# EasyEDA Pro project ProPrj_STM32G474RET6_2026-01-30.epro, board PCB1
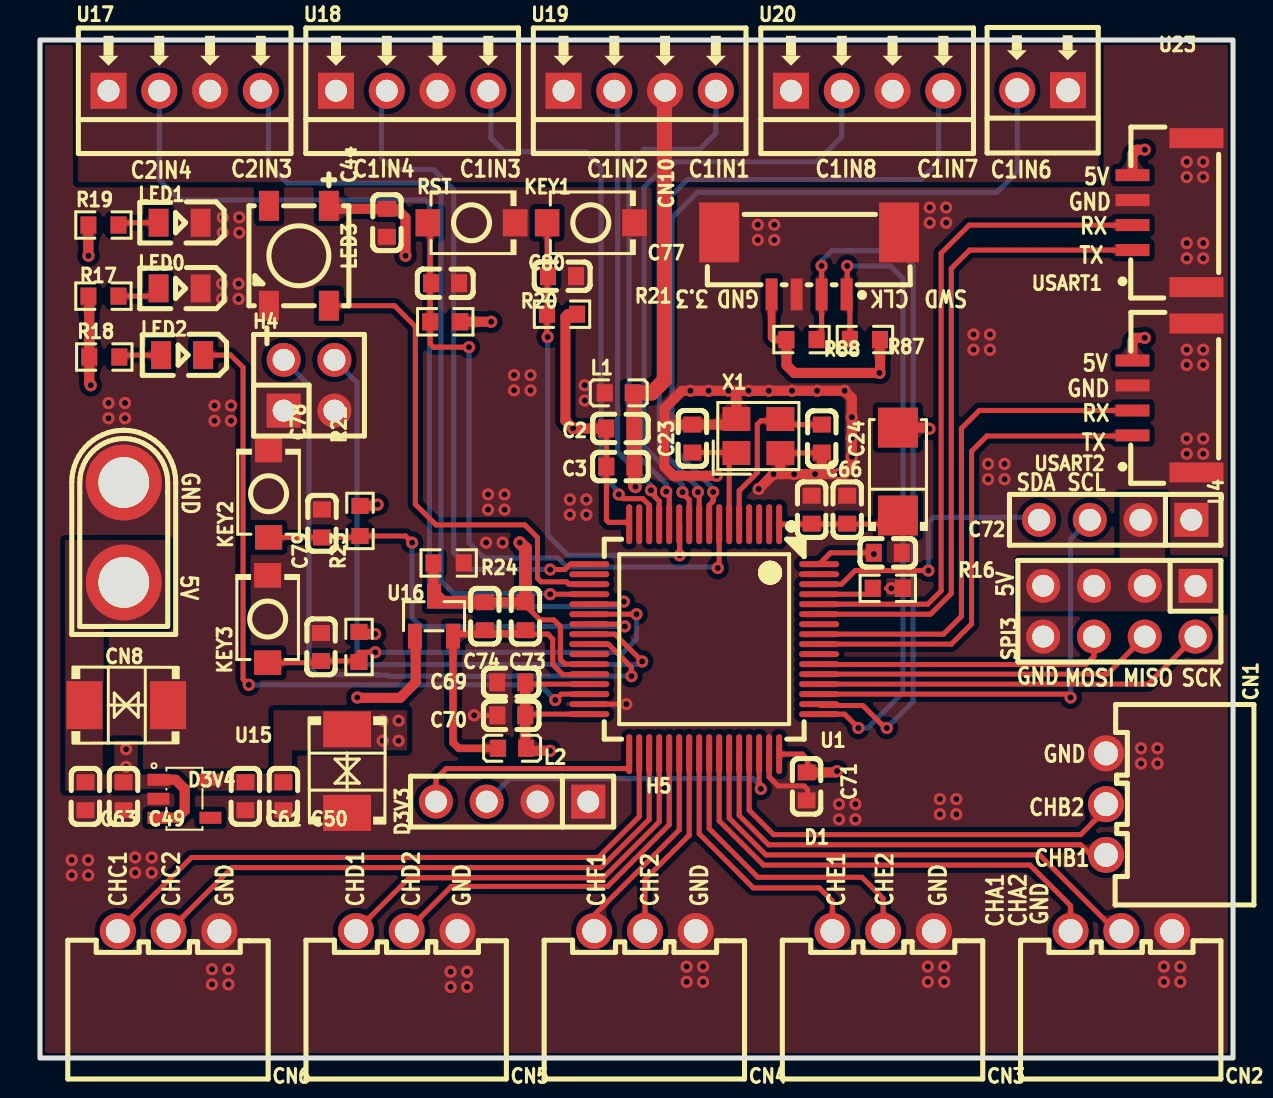
[diagram p2: board, top side]
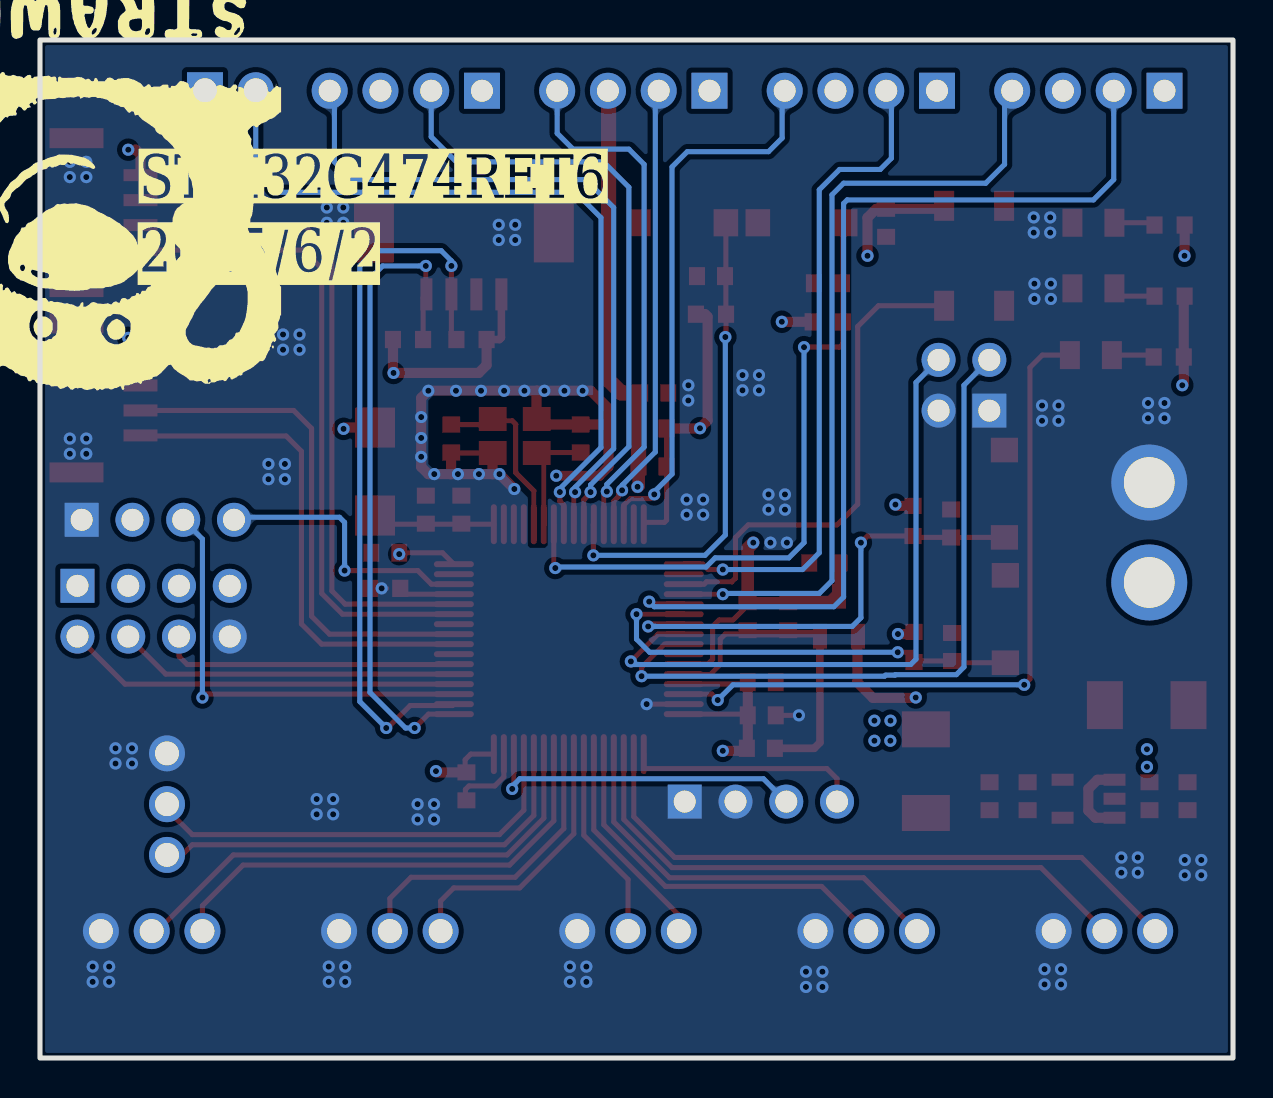
[diagram p3: board, bottom side, seen from below]

Outline 59.69 x 50.93 mm; copper layers: Top Layer, Inner1, Inner2, Bottom Layer. Coordinates in mm from the lower left corner of the outline.
Outline path: rectangle 0,50.93 59.69,0
Stack: Top Layer 0.035mm 外层铜厚1oz / Dielectric1 0.2104mm 7628 RC49% 8.6mil / Inner1 0.0152mm 内层铜厚 / Dielectric2 1.065mm 1.1mm H/HOZ Copper / Inner2 0.0152mm 内层铜厚 / Dielectric3 0.2104mm 7628 RC49% 8.6mil / Bottom Layer 0.035mm 外层铜厚1oz

## Design rules (mm)
template: 自定义配置
spacing copperThickness1oz (default): track to track 0.102, other pairs 0.152 to 0.3
spacing copperThickness2oz: track to track 0.203, other pairs 0.152 to 0.3
track width copperThickness1oz (default): min 0.127, default 0.254, max 2.54
track width copperThickness2oz: min 0.203, default 0.254, max 2.54
differential pair differentialPair (default): width min 0.127, default 0.254, max 2.54; gap min 0.152, default 0.152
via viaSize (default): diameter min 0.5, default 0.61, max 10; hole min 0.3, default 0.305, max 6.299

## Placement (name value [footprint] x y rotation side)
C2  10uF  [C0603]  29.04 31.49 180 top
C3  100nF  [C0603]  29.04 29.59 180 top
C23  12pF  [C0603]  32.64 30.99 270 top
C24  12pF  [C0603]  39.12 30.99 90 top
C44  100nF  [C0603]  17.36 41.78 270 top
C49  100nF  [C0603]  4.18 13.1 90 top
C50  100nF  [C0603]  12.18 13.1 90 top
C61  1uF  [C0603]  10.28 13.1 90 top
C63  1uF  [C0603]  2.28 13.1 90 top
C65  100nF  [C0603]  38.61 27.43 270 top
C66  100nF  [C0603]  40.39 27.43 270 top
C69  100nF  [C0603]  23.58 18.79 0 top
C70  100nF  [C0603]  23.58 17.14 0 top
C71  100nF  [C0603]  38.35 13.59 90 top
C72  100nF  [C0603]  42.42 25.27 180 top
C73  1uF  [C0603]  24.29 22.1 270 top
C74  10nF  [C0603]  22.26 22.1 270 top
C77  100nF  [C0603]  26.12 39.11 180 top
C78  100nF  [C0603]  14.1 26.74 270 top
C79  100nF  [C0603]  14.06 20.56 270 top
C80  100nF  [C0603]  20.27 38.76 180 top
CN1  XH-3AW  [CONN-TH_3P-P2.54_HCTL_XH-3AW]  53.33 12.7 270 top
CN2  XH-3AW  [CONN-TH_3P-P2.54_HCTL_XH-3AW]  54.1 6.35 180 top
CN3  XH-3AW  [CONN-TH_3P-P2.54_HCTL_XH-3AW]  42.18 6.35 180 top
CN4  XH-3AW  [CONN-TH_3P-P2.54_HCTL_XH-3AW]  30.27 6.35 180 top
CN5  XH-3AW  [CONN-TH_3P-P2.54_HCTL_XH-3AW]  18.35 6.35 180 top
CN6  XH-3AW  [CONN-TH_3P-P2.54_HCTL_XH-3AW]  6.43 6.35 180 top
CN8  XT30U-M  [CONN-TH_XT30U-M]  4.19 26.29 90 top
CN10  HCZZ0015-4  [CONN-SMD_4P-P1.25_HCZZ0015-4]  38.48 39.75 180 top
D1  SS34-A  [SMA_L4.3-W2.6-LS5.2-RD]  42.93 29.34 90 top
D3V3  SMBJ3.3CA  [SMB_L4.6-W3.5-LS5.3-BI]  15.37 14.35 90 top
D3V4  SMBJ3.3CA  [SMB_L4.6-W3.5-LS5.3-BI]  4.32 17.65 180 top
H4  PZ254V-12-4P  [HDR-TH_4P-P2.54-V-M-R2-C2-S2.54]  13.46 33.66 0 top
H5  PZ254V-11-04P  [HDR-TH_4P-P2.54-V-M]  23.62 12.83 180 top
KEY1  SKRKAEE020  [SW-SMD_L3.9-W3.0-P4.45]  27.56 41.78 0 top
KEY2  SKRKAEE020  [SW-SMD_L3.9-W3.0-P4.45]  11.44 28.23 90 top
KEY3  SKRKAEE020  [SW-SMD_L3.9-W3.0-P4.45]  11.39 21.96 90 top
L1  BLM18PG121SN1D  [L0603]  28.96 33.27 0 top
L2  BLM18PG121SN1D  [L0603]  23.62 15.49 180 top
LED0  17-21SURC/S530-A3/TR8  [LED0805-R-RD]  6.98 38.5 180 top
LED1  17-21SURC/S530-A3/TR8  [LED0805-R-RD]  6.98 41.79 180 top
LED2  17-21SURC/S530-A3/TR8  [LED0805-R-RD]  7.11 35.16 180 top
LED3  XL-5050RGBC-WS2812B  [LED-SMD_4P-L5.0-W5.0-BL_XL-5050RGBC]  12.95 40.13 180 top
R16  10kΩ  [R0603]  42.42 23.5 0 top
R17  1kΩ  [R0603]  3.17 38.11 0 top
R18  1kΩ  [R0603]  3.22 35.07 0 top
R19  5kΩ  [R0603]  3.17 41.67 0 top
R20  1kΩ  [R0603]  20.28 36.83 180 top
R21  1kΩ  [R0603]  26.12 37.21 180 top
R22  1kΩ  [R0603]  16.01 26.87 270 top
R23  1kΩ  [R0603]  15.96 20.56 270 top
R24  0Ω  [R0603]  20.45 24.77 180 top
R87  3.3kΩ  [R0603]  41.27 35.94 0 top
R88  3.3kΩ  [R0603]  38.1 35.94 180 top
RST  SKRKAEE020  [SW-SMD_L3.9-W3.0-P4.45]  21.59 41.78 0 top
SPI3  PZ254V-12-8P  [HDR-TH_8P-P2.54-V-M-R2-C4-S2.54]  54 22.35 180 top
U1  STM32G474RET6  [LQFP-64_L10.0-W10.0-P0.50-LS12.0-BL]  33.23 20.95 180 top
U4  HC-PZ254-11.5L-1x4PZ  [HDR-TH_4P-P2.54-V-M-4]  53.79 26.92 180 top
U15  LP5907MFX-3.3  [SOT-23-5_L3.0-W1.7-P0.95-LS2.8-BR]  7.23 12.97 180 top
U16  REF3033AIDBZRQ1  [SOT-23-3_L2.9-W1.3-P1.90-LS2.4-BR]  19.72 22.1 270 top
U17  DB125-2.54-4P-GN-S  [CONN-TH_DB125-2.54-4P-GN]  7.24 48.39 0 top
U18  DB125-2.54-4P-GN-S  [CONN-TH_DB125-2.54-4P-GN]  18.62 48.39 0 top
U19  DB125-2.54-4P-GN-S  [CONN-TH_DB125-2.54-4P-GN]  30 48.39 0 top
U20  DB125-2.54-4P-GN-S  [CONN-TH_DB125-2.54-4P-GN]  41.39 48.39 0 top
U23  DB125-2.54-2P-GN-S  [CONN-TH_DB125-2.54-2P-GN]  50.17 48.41 180 top
USART1  SM04B-GHS-TB(LF)(SN)  [CONN-SMD_4P-P1.25_SM04B-GHS-TB-LF-SN]  56.26 42.29 90 top
USART2  SM04B-GHS-TB(LF)(SN)  [CONN-SMD_4P-P1.25_SM04B-GHS-TB-LF-SN]  56.26 33.02 90 top
X1  12MHz  [CRYSTAL-SMD_4P-L3.2-W2.5-BL]  35.94 31.12 0 top

## Footprints (pads in the part's own frame, mm; a bottom-side part is the same pattern mirrored in y, then rotated)
C0603
  rect 0.8x0.9 smd: 1(-0.7,0) 2(0.7,0)
CONN-SMD_4P-P1.25_HCZZ0015-4
  rect 0.6x1.6 smd: 1(-1.875,1.55) 2(-0.625,1.55) 3(0.625,1.55) 4(1.875,1.55)
  rect 2x3 smd: 5(-4.5,-1.55) 6(4.5,-1.55)
CONN-SMD_4P-P1.25_SM04B-GHS-TB-LF-SN
  rect 0.6x1.7 smd: 1(-1.875,1.599) 2(-0.625,1.599) 3(0.625,1.599) 4(1.875,1.599)
  rect 1x2.7 smd: 5(3.724,-1.599) 6(-3.724,-1.599)
CONN-TH_3P-P2.54_HCTL_XH-3AW
  round 1.8 hole 1.199: 1(-2.54,0) 2(0.002,0) 3(2.54,0)
CONN-TH_DB125-2.54-2P-GN
  rect 1.8x1.8 hole 1.2: 1(-1.27,0)
  round 1.8 hole 1.2: 2(1.27,0)
CONN-TH_DB125-2.54-4P-GN
  rect 1.8x1.8 hole 1.1: 1(-3.81,0)
  round 1.8 hole 1.1: 2(-1.27,0) 3(1.27,0) 4(3.81,0)
CONN-TH_XT30U-M
  round 3.8 hole 2.54: 1(-2.5,0) 2(2.5,0)
CRYSTAL-SMD_4P-L3.2-W2.5-BL
  rect 1.4x1.2 smd: 1(-1.1,-0.85) 2(1.1,-0.85) 3(1.1,0.85) 4(-1.1,0.85)
HDR-TH_4P-P2.54-V-M
  rect 1.7x1.7 hole 1.1: 1(-3.81,0)
  round 1.7 hole 1.1: 2(-1.27,0) 3(1.27,0) 4(3.81,0)
HDR-TH_4P-P2.54-V-M-4
  rect 1.7x1.7 hole 1.1: 1(-3.81,0)
  round 1.7 hole 1.1: 2(-1.27,0) 3(1.27,0) 4(3.81,0)
HDR-TH_4P-P2.54-V-M-R2-C2-S2.54
  rect 1.7x1.7 hole 1.1: 1(-1.27,-1.27)
  round 1.7 hole 1.1: 2(-1.27,1.27) 3(1.27,-1.27) 4(1.27,1.27)
HDR-TH_8P-P2.54-V-M-R2-C4-S2.54
  rect 1.7x1.7 hole 1.1: 1(-3.81,-1.27)
  round 1.7 hole 1.1: 2(-3.81,1.27) 3(-1.27,-1.27) 4(-1.27,1.27) 5(1.27,-1.27) 6(1.27,1.27) 7(3.81,-1.27) 8(3.81,1.27)
L0603
  rect 0.8x0.864 smd: 1(-0.7,0) 2(0.7,0)
LED0805-R-RD
  rect 1x1.399 smd: 1(1.05,0) 2(-1.05,0)
LED-SMD_4P-L5.0-W5.0-BL_XL-5050RGBC
  rect 1x1.5 smd: 1(-1.5,-2.5) 2(1.5,-2.5) 3(1.5,2.5) 4(-1.5,2.5)
LQFP-64_L10.0-W10.0-P0.50-LS12.0-BL
  oval 0.3x2 smd: 1(-3.75,-5.75) 2(-3.25,-5.75) 3(-2.75,-5.75) 4(-2.25,-5.75) 5(-1.75,-5.75) 6(-1.25,-5.75) 7(-0.75,-5.75) 8(-0.25,-5.75) 9(0.25,-5.75) 10(0.75,-5.75) 11(1.25,-5.75) 12(1.75,-5.75) 13(2.25,-5.75) 14(2.75,-5.75) 15(3.25,-5.75) 16(3.75,-5.75) 33(3.75,5.75) 34(3.25,5.75) 35(2.75,5.75) 36(2.25,5.75) 37(1.75,5.75) 38(1.25,5.75) 39(0.75,5.75) 40(0.25,5.75) 41(-0.25,5.75) 42(-0.75,5.75) 43(-1.25,5.75) 44(-1.75,5.75) 45(-2.25,5.75) 46(-2.75,5.75) 47(-3.25,5.75) 48(-3.75,5.75)
  oval 2x0.3 smd: 17(5.75,-3.75) 18(5.75,-3.25) 19(5.75,-2.75) 20(5.75,-2.25) 21(5.75,-1.75) 22(5.75,-1.25) 23(5.75,-0.75) 24(5.75,-0.25) 25(5.75,0.25) 26(5.75,0.75) 27(5.75,1.25) 28(5.75,1.75) 29(5.75,2.25) 30(5.75,2.75) 31(5.75,3.25) 32(5.75,3.75) 49(-5.75,3.75) 50(-5.75,3.25) 51(-5.75,2.75) 52(-5.75,2.25) 53(-5.75,1.75) 54(-5.75,1.25) 55(-5.75,0.75) 56(-5.75,0.25) 57(-5.75,-0.25) 58(-5.75,-0.75) 59(-5.75,-1.25) 60(-5.75,-1.75) 61(-5.75,-2.25) 62(-5.75,-2.75) 63(-5.75,-3.25) 64(-5.75,-3.75)
R0603
  rect 0.806x0.864 smd: 1(-0.753,0) 2(0.753,0)
SMA_L4.3-W2.6-LS5.2-RD
  rect 2x2 smd: 1(-2.2,0) 2(2.2,0)
SMB_L4.6-W3.5-LS5.3-BI
  rect 1.8x2.4 smd: 1(-2.091,0) 2(2.091,0)
SOT-23-3_L2.9-W1.3-P1.90-LS2.4-BR
  rect 1.25x0.7 smd: 1(1,-0.95) 2(1,0.95) 3(-1,0)
SOT-23-5_L3.0-W1.7-P0.95-LS2.8-BR
  rect 1.1x0.6 smd: 1(1.3,-0.95) 2(1.3,0) 3(1.3,0.95) 4(-1.3,0.95) 5(-1.3,-0.95)
SW-SMD_L3.9-W3.0-P4.45
  rect 1.23x1.36 smd: 1(-2.185,0) 2(2.185,0)

## Nets
As in the schematic, except:
+5V: C44.1 C49.2 C63.2 CN8.1 D3V4.2 LED3.1 R19.1 SPI3.1 SPI3.3 SPI3.5 SPI3.7 U4.2 U15.1 U15.3 U16.1 USART1.4 USART2.4
GND: C23.1 C24.1 C44.2 C49.1 C50.1 C61.1 C63.1 C65.1 C66.1 C69.1 C70.1 C71.1 C72.1 C77.1 C78.1 C79.1 C80.1 CN1.1 CN2.1 CN3.1 CN4.1 CN5.1 CN6.1 CN8.2 CN10.3 CN10.5 CN10.6 D3V3.1 D3V4.1 H4.1 H4.3 H5.1 H5.2 KEY1.2 KEY2.2 KEY3.2 L1.1 LED0.2 LED1.2 LED3.3 R16.2 R24.1 RST.2 SPI3.8 U1.15 U1.31 U1.47 U1.63 U4.1 U15.2 USART1.3 USART1.5 USART1.6 USART2.3 USART2.5 USART2.6 X1.2 X1.4
PC10: SPI3.2 U1.52
PC11: SPI3.4 U1.53
PC12: SPI3.6 U1.54
PG10_NRST: C80.2 R20.2 RST.1 U1.7

Pads without a net: LED3 2; U15 4

## Via types
v1: diameter 0.61, hole 0.305, Top Layer to Bottom Layer, 175 vias

## Routing (per net, layer and track width the routed paths; a pad name or vN(x,y) marks a point on that pad's centre or on a via; arc(x,y) is an arc through that point)
3.3V: length 156.2
  Top Layer w0.254: U1.48 38.14,15.2 38.42,14.92 38.42,14.29 ; U1.16 29.39,26.8 28.45,26.8 28.34,26.91 C3.2 C2.2 ; U1.64 39.55,25.27 C72.2 ; U1.32 24.59,17.2 24.28,16.89 ; U1.29 24.31,18.7 24.28,18.67
  Top Layer w0.381: R88.2 36.7,35.94 36.61,36.04 CN10.4
  Top Layer w0.508: R88.2 37.35,34.66 37.74,34.27 41.94,34.27 42.03,34.36 R87.2 ; R20.1 22.57,36.83 ; v1(44.5,31.47) 44.44,31.54 42.93,31.54 ; 26.87,37.21 26.41,37.21 26.29,37.08 26.29,31.89 v1(26.67,31.5) 26.68,31.49 C2.2 ; v1(2.54,33.66) 2.46,33.73 R18.1 2.46,38.07 R17.1 ; v1(39.88,14.35) 39.82,14.29 C71.2 ; v1(16.76,21.21) 16.07,21.21 R23.1 ; R22.1 16.83,27.62 v1(16.89,27.69) ; 24.28,18.67 24.28,15.54 L2.1 24.45,15.37 v1(25.53,15.37)
  Inner2 w0.508: 17.55,27.69 v1(16.89,27.69) ; 17.55,27.69 17.62,27.76 ; 17.55,27.69 17.55,27.83 ; 39.84,15.37 44.32,15.37 45.21,16.26 45.21,25.3 ; 39.84,15.37 39.88,15.33 v1(39.88,14.35) ; 39.84,15.37 v1(25.53,15.37) 18.45,15.37 v1(17.94,15.87) ; 22.57,31.5 17.55,31.5 ; 22.57,31.5 v1(22.57,36.83) ; 22.57,31.5 v1(26.67,31.5) ; 17.55,31.5 17.55,27.83 ; 17.55,31.5 17.55,32.47 17.56,32.48 16.38,33.66 v1(2.54,33.66) ; 45.21,31.5 44.52,31.5 v1(44.5,31.47) ; 45.21,31.5 45.21,25.3 ; 45.21,31.5 45.21,34.04 44.98,34.27 v1(42,34.27) ; 17.62,27.76 17.62,26.44 17.63,26.42 17.63,21.21 ; 17.62,27.76 17.55,27.83 ; v1(16.76,21.21) 16.77,21.21 17.63,21.21 ; v1(17.94,15.87) v1(17.94,16.88) ; v1(17.94,15.87) v1(17.15,15.87) 17.15,16.87 v1(17.14,16.88) ; 17.53,16.76 17.63,16.87 17.63,21.21 ; 45.21,25.3 41.81,25.3 v1(41.72,25.21)
+5V: length 170.7
  Top Layer w0.508: USART2.4 54.66,35.87 54.82,36.03 v1(55.27,36.03) ; R19.1 2.42,40.14 v1(2.43,40.13) ; v1(18.29,40.13) 18.29,42.04 17.84,42.48 14.6,42.48 LED3.1 ; U15.1 6.78,13.92 7.24,13.46 7.24,12.38 6.88,12.02 U15.3 ; USART1.4 54.66,45.21 54.89,45.44 v1(55.27,45.44) ; 18.77,21.23 18.8,21.23 18.8,18.8 18.02,18.02 15.87,18.02
  Inner2 w0.508: 4.31,15.11 14.99,15.11 15.87,16 v1(15.87,18.03) ; 4.31,15.11 v1(4.31,14.57) ; 4.31,15.11 v1(4.31,15.45)
  Inner2 w0.635: v1(18.29,40.13) v1(2.43,40.13) 1.65,40.13 1.14,39.62 1.14,15.88 1.91,15.11 4.31,15.11
  Inner2 w0.762: SPI3.3 v1(55.27,36.03) v1(55.27,45.44) ; v1(4.31,14.57) 4.31,11.06 4.44,10.92 46.1,10.92 47.24,12.07 47.24,22.99 47.75,23.5 57.69,23.5 SPI3.1
AGND: length 44.2
  Top Layer w0.254: U1.27 26.27,19.7 26.04,19.94 26.04,21.59 25.71,21.92 25.02,21.92 24.38,22.55 24.38,22.71 C73.1
  Top Layer w0.508: 19.69,23.25 R24.2 ; C73.1 C74.1
  Top Layer w0.635: C3.1 29.74,28.63 v1(29.79,28.58) ; C73.1 24.29,25.5 v1(24,25.78) ; C74.1 20.14,22.8 19.72,23.23
  Top Layer w0.762: U19.3 31.24,48.36 31.24,33.91 30.61,33.27 L1.2 29.74,33.19 C2.1 C3.1
  Inner2 w0.635: v1(29.79,28.58) 29.79,26.49 29.08,25.78 v1(24,25.78)
GND: length 41.4
  Top Layer w0.254: 39.12,30.54 38.84,30.27 37.04,30.27 ; R16.2 42.35,23.5 ; C71.1 38.41,12.94 38.41,13.43 38.23,13.61 36.94,13.61 36.48,14.07 U1.47 ; U1.31 v1(29.34,17.7) ; 22.88,17.14 v1(21.72,17.14)
  Top Layer w0.508: 31.24,31.58 31.35,31.69 C23.1 34.56,31.69 X1.4 34.84,33.37 34.83,33.38 ; 31.24,31.58 31.24,29.59 31.7,29.13 v1(33.86,29.13) ; 31.24,31.58 31.24,32.49 32.13,33.38 v1(32.54,33.38) v1(33.45,33.38) v1(34.45,33.38) 34.83,33.38 ; 34.83,33.38 v1(35.45,33.38) v1(36.47,33.38) v1(37.62,33.38) v1(38.88,33.38) v1(40.26,33.38) 40.62,33.02 v1(40.62,32.06) v1(40.62,31.02) v1(40.62,30.08) 40.62,29.57 40.26,29.21 39.15,29.21 ; 37.04,30.27 37.04,29.22 37.05,29.21 ; 37.05,29.21 v1(37.73,29.21) v1(38.78,29.21) 39.15,29.21 ; 37.05,29.21 v1(36.7,29.21) v1(35.96,28.46) ; 39.15,29.21 39.12,29.24 C24.1
  vias: v1(1.59,9.91) v1(1.59,9.14) v1(2.41,9.91) v1(2.41,9.14) v1(3.43,32.77) v1(3.43,32) v1(4.25,32.77) v1(4.25,32) v1(4.76,10.03) v1(4.76,9.27) v1(5.59,10.03) v1(5.59,9.27) v1(8.61,4.45) v1(8.61,3.68) v1(8.73,32.64) v1(8.73,31.88) v1(9.15,42.05) v1(9.15,41.29) v1(9.11,38.74) v1(9.11,37.97) v1(9.43,4.45) v1(9.43,3.68) v1(9.56,32.64) v1(9.56,31.88) v1(9.94,38.74) v1(9.94,37.97) v1(9.97,42.05) v1(9.97,41.29) v1(20.54,4.32) v1(20.54,3.56) v1(21.37,4.32) v1(21.37,3.56) v1(22.32,25.78) v1(22.42,28.19) v1(22.42,27.43) v1(23.14,25.78) v1(23.24,28.19) v1(23.24,27.43) v1(23.72,34.16) v1(23.72,33.4) v1(24.54,34.16) v1(24.54,33.4) v1(26.51,27.94) v1(26.51,27.18) v1(27.25,33.65) v1(27.25,32.89) v1(27.34,27.94) v1(27.34,27.18) v1(32.35,4.57) v1(32.35,3.81) v1(33.18,4.57) v1(33.18,3.81) v1(35.91,41.68) v1(35.91,40.92) v1(36.74,41.68) v1(36.74,40.92) v1(39.96,29.21) v1(39.97,12.7) v1(39.97,11.94) v1(40.8,12.7) v1(40.8,11.94) v1(42.59,23.5) v1(44.42,4.57) v1(44.42,3.81) v1(44.52,42.55) v1(44.52,41.78) v1(45.02,12.95) v1(45.02,12.19) v1(45.24,4.57) v1(45.24,3.81) v1(45.34,42.55) v1(45.34,41.78) v1(45.85,12.95) v1(45.85,12.19) v1(46.7,36.2) v1(46.7,35.43) v1(47.44,29.72) v1(47.44,28.96) v1(47.53,36.2) v1(47.53,35.43) v1(48.26,29.72) v1(48.26,28.96) v1(55.09,15.49) v1(55.09,14.73) v1(55.91,15.49) v1(55.91,14.73) v1(56.23,4.57) v1(56.23,3.81) v1(57.05,4.57) v1(57.05,3.81) v1(57.37,44.83) v1(57.37,44.07) v1(57.37,40.77) v1(57.37,40.01) v1(57.37,35.43) v1(57.37,34.67) v1(57.37,30.99) v1(57.37,30.23) v1(58.2,44.83) v1(58.2,44.07) v1(58.2,40.77) v1(58.2,40.01) v1(58.2,35.43) v1(58.2,34.67) v1(58.2,30.99) v1(58.2,30.23)
VBAT: length 6.6
  Top Layer w0.254: 42.93,27.65 42.52,27.24 ; U1.1 42.75,26.7 42.93,26.88
ADC1_IN1: length 26
  Top Layer w0.254: v1(31.33,28.34) 31.48,28.19 U1.12
  Bottom Layer w0.254: U19.4 33.81,46.26 33.02,45.47 30.23,45.47 29.46,44.7 29.46,30.56 31.33,28.7 v1(31.33,28.34)
ADC1_IN2: length 22.6
  Top Layer w0.254: U1.13 30.98,27.86 30.75,28.1 30.75,28.22 v1(30.57,28.4)
  Bottom Layer w0.254: v1(30.57,28.4) 30.57,28.65 28.9,30.32 28.9,48.22 U19.2
ADC1_IN3: length 28
  Top Layer w0.254: v1(28.96,28.19) 29.17,27.98 30.16,27.98 30.48,27.66 U1.14
  Bottom Layer w0.254: 22.56,48.39 22.56,46.02 23.24,45.34 27.3,45.34 28.07,44.58 28.07,29.21 29.08,28.19
ADC1_IN4: length 33.1
  Top Layer w0.254: U1.17 26.52,24.7 26.26,24.44 v1(25.53,24.44)
  Bottom Layer w0.254: U18.2 17.09,48.13 17.09,45.01 17.65,44.45 19.68,44.45 20.7,43.43 20.7,25.27 21.54,24.44 v1(25.53,24.44)
ADC1_IN6: length 38.6
  Top Layer w0.254: U1.8 33.48,27.66 33.68,27.86 v1(33.68,28.31)
  Bottom Layer w0.254: U23.2 48.89,44.32 47.88,43.31 32.89,43.31 31.62,42.04 31.62,30.54 33.68,28.48 v1(33.68,28.31)
ADC1_IN7: length 35.2
  Top Layer w0.254: v1(32.92,28.31) 32.98,28.25 U1.9
  Bottom Layer w0.254: U20.4 44.96,48.15 44.96,44.83 44.07,43.94 32.39,43.94 30.99,42.55 30.99,30.48 32.92,28.54 32.92,28.31 v1(32.92,28.31)
ADC1_IN8: length 31
  Top Layer w0.254: v1(32.14,28.31) 32.14,28.26 32.48,27.92 U1.10
  Bottom Layer w0.254: U20.2 40.12,46.08 38.86,44.83 31.5,44.83 30.23,43.56 30.23,30.59 32.14,28.67 v1(32.14,28.31)
ADC2_IN3: length 40.1
  Top Layer w0.254: U1.20 v1(25.53,23.2)
  Bottom Layer w0.254: U17.4 11.43,48.01 11.43,44.7 12.37,43.76 19.48,43.76 20.07,43.18 20.07,23.88 20.7,23.24 25.49,23.24 v1(25.53,23.2)
ADC2_IN4: length 50
  Top Layer w0.254: U1.21 29.08,22.7 v1(29.21,22.83)
  Bottom Layer w0.254: v1(29.21,22.83) 28.96,22.58 19.97,22.58 19.48,23.06 19.48,42.75 19.3,42.93 6.98,42.93 5.97,43.94 5.97,48.39
HRTIM1_CHA1: length 24.5
  Top Layer w0.254: 33.98,15.71 33.98,11.87 36.2,9.65 49.53,9.65 51.56,7.62 CN2.3
HRTIM1_CHA2: length 25.7
  Top Layer w0.254: CN2.2 53.83,6.35 50.02,10.16 36.32,10.16 34.48,12 34.48,15.71
HRTIM1_CHB1: length 21.5
  Top Layer w0.254: U1.44 34.98,12.14 36.45,10.67 52.07,10.67 52.58,10.16
HRTIM1_CHB2: length 22.1
  Top Layer w0.254: 53.59,12.7 52.07,11.18 36.7,11.18 35.48,12.4 U1.45
HRTIM1_CHC1: length 32.1
  Top Layer w0.254: 29.98,15.71 29.98,12.07 27.94,10.03 7.58,10.03 CN6.3
HRTIM1_CHC2: length 30.1
  Top Layer w0.254: CN6.2 9.61,9.53 28.07,9.53 30.48,11.94 30.48,15.71
HRTIM1_CHD1: length 21.3
  Top Layer w0.254: CN5.3 18.48,9.02 28.18,9.02 30.98,11.81 30.98,15.71
HRTIM1_CHD2: length 19.4
  Top Layer w0.254: 31.48,15.71 31.48,11.67 28.4,8.58 20.58,8.58 CN5.2
HRTIM1_CHE1: length 14.1
  Top Layer w0.254: CN3.3 39.64,7.85 38.99,8.51 35.69,8.51 32.98,11.21 32.98,15.71
HRTIM1_CHE2: length 16
  Top Layer w0.254: CN3.2 42.18,7.98 41.12,9.04 35.92,9.04 33.48,11.48 33.48,15.71
HRTIM1_CHF1: length 11.1
  Top Layer w0.254: CN4.3 27.73,7.15 31.98,11.41 31.98,15.71
HRTIM1_CHF2: length 10.3
  Top Layer w0.254: 32.48,15.71 32.48,11.15 30.27,8.93 CN4.2
I2C1_SCL: length 21.9
  Top Layer w0.254: v1(51.56,18.03) 51.39,18.2 U1.51
  Bottom Layer w0.254: v1(51.56,18.03) 51.56,25.96 U4.3
I2C1_SDA: length 13.9
  Top Layer w0.254: U1.62 40.11,23.7 40.79,24.38 v1(44.45,24.38)
  Bottom Layer w0.254: v1(44.45,24.38) 44.45,26.8 44.7,27.05 49.86,27.05 U4.4
KEY1: length 24.3
  Top Layer w0.254: v1(32,25.15) 32,26.68 U1.11 ; 25.62,37.21 25.37,37.46 KEY1.1 ; v1(25.4,36.07) 25.37,36.1 R21.2
  Bottom Layer w0.254: v1(25.4,36.07) 25.4,26.16 26.42,25.15 v1(32,25.15)
KEY2: length 23.8
  Top Layer w0.254: U1.23 29.15,21.7 v1(29.26,21.59) ; v1(18.62,25.78) 18.29,26.11 16.01,26.11 15.94,26.04 KEY2.1
  Bottom Layer w0.254: v1(18.62,25.78) 18.62,22.02 19.05,21.59 v1(29.26,21.59)
KEY3: length 22.9
  Top Layer w0.254: v1(16.77,20.3) 15.98,20.3 15.96,20.28 R23.2 15.91,19.86 C79.2 13.97,19.78 KEY3.1 ; U1.22 v1(29.84,22.2)
  Bottom Layer w0.254: v1(16.77,20.3) 29.19,20.3 29.84,20.96 v1(29.84,22.2)
LED(TIM2CH3): length 35.7
  Top Layer w0.254: U1.30 26.08,18.2 v1(25.78,17.91) ; v1(10.45,18.67) 10.16,18.96 10.16,34.54 9.54,35.16 LED2.2
  Bottom Layer w0.254: v1(10.45,18.67) 25.02,18.67 v1(25.78,17.91)
PA5: length 25.2
  Top Layer w0.254: LED3.4 17.74,37.63 18.78,36.59 18.78,27.7 19.81,26.67 24.26,26.67 24.89,26.04 24.89,24 25.07,23.82 26.34,23.82 26.46,23.7 U1.19
PA12: length 16.3
  Top Layer w0.254: U1.46 35.98,13.76 35.97,13.75 35.98,13.74 35.98,13.55 v1(36.07,13.46)
  Bottom Layer w0.254: v1(36.07,13.46) 36.07,13.59 35.69,13.97 23.49,13.97 H5.3
PA13: length 32.7
  Top Layer w0.254: U1.49 40.25,17.2 v1(40.95,16.51) ; R87.1 40.52,38.04 CN10.1 40.39,38.23 v1(40.39,39.62)
  Bottom Layer w0.254: v1(40.95,16.51) 41.4,16.51 43.18,18.29 43.18,38.99 42.55,39.62 v1(40.39,39.62)
PA14: length 36.7
  Top Layer w0.254: U1.50 39.05,17.63 41.17,17.63 42.29,16.51 v1(42.37,16.51) ; R88.1 39.11,36.19 CN10.2 v1(39.11,39.62)
  Bottom Layer w0.254: v1(39.11,39.62) 39.11,39.88 39.61,40.39 42.93,40.39 43.69,39.62 43.69,17.83 v1(42.37,16.51)
PB0: length 33.1
  Top Layer w0.254: U1.24 28.76,21.2 v1(30.13,19.84)
  Bottom Layer w0.254: H4.4 15.86,33.8 15.86,19.95 16.13,19.69 29.97,19.69 v1(30.13,19.84)
PB1: length 35.2
  Top Layer w0.254: v1(29.59,19.1) 29.59,19.55 28.44,20.7 U1.25
  Bottom Layer w0.254: H4.2 13.46,33.66 13.46,19.56 13.84,19.18 16.89,19.18 16.92,19.15 17.38,19.15 17.43,19.1 v1(29.59,19.1)
PB3: length 25.1
  Top Layer w0.254: USART2.1 54.41,31.14 54.38,31.12 47.37,31.12 46.61,30.35 46.61,21.72 45.6,20.7 U1.56
PB4: length 25.8
  Top Layer w0.254: USART2.2 47,32.39 46.1,31.5 46.1,22.1 45.21,21.2 U1.57
PB6: length 32.7
  Top Layer w0.254: U1.59 44.55,22.2 45.59,23.24 45.59,39.5 46.51,40.42 USART1.1
PB7: length 33.4
  Top Layer w0.254: USART1.2 46.49,41.67 45.08,40.26 45.08,23.37 44.42,22.7 U1.60
PB8_BOOT0: length 2.8
  Top Layer w0.254: R16.1 41.37,23.2 U1.61
PB11: length 11.7
  Top Layer w0.254: U1.33 29.48,14.48 20.32,14.48 19.81,13.97 H5.4
PC10: length 19.8
  Top Layer w0.254: SPI3.2 55.44,18.7 U1.52
PC11: length 17.1
  Top Layer w0.254: SPI3.4 53.4,19.2 U1.53
PC12: length 14.9
  Top Layer w0.254: SPI3.6 52.73,20.1 52.32,19.69 39.75,19.69 39.73,19.7 U1.54
PF0_OSC_IN: length 8.8
  Top Layer w0.254: U1.5 34.98,28.38 35.89,29.28 35.89,31.7 36.07,31.88 36.95,31.88 37.04,31.97 37.32,31.69 C24.2
PF1_OSC_OUT: length 5.1
  Top Layer w0.254: 34.48,29.91 U1.6 ; 34.48,30.24 34.44,30.29 C23.2
PG10_NRST: length 33.1
  Top Layer w0.254: v1(33.91,24.51) 33.98,24.58 U1.7 ; RST.1 19.52,41.66 R20.2 19.52,35.72 19.68,35.56 v1(21.46,35.56)
  Bottom Layer w0.254: v1(33.91,24.51) 33.86,24.56 26.36,24.56 25.91,25.02 22.23,25.02 21.46,25.78 v1(21.46,35.56)
VREF: length 16.5
  Top Layer w0.254: U1.28 27.46,19.18 26.16,19.18 25.65,19.69 25.65,20.96 25.4,21.21 24.29,21.21 C73.2
  Top Layer w0.381: L2.2 20.95,15.49 20.67,15.78 20.67,21.23 24.11,21.23 C73.2
$1N8464: length 2.1
  Top Layer w0.254: R19.2 4.04,41.79 LED1.1
$1N8465: length 2.2
  Top Layer w0.254: R17.2 5.55,38.11 LED0.1
$1N8471: length 2.1
  Top Layer w0.254: LED2.1 4.07,35.16 R18.2

## Copper pours and planes (outline as drawn; the poured copper is in the pictures)
3.3V on Top Layer: 7.87,14.22 12.61,14.22 12.61,13.38 7.87,13.38
3.3V on Top Layer: 11.68,17.4 12.61,17.4 12.61,13.37 11.68,13.37
3.3V on Top Layer: 11.72,17.4 18.37,17.4 18.37,15.39 11.72,15.39
3.3V on Inner2: 16.73,17.4 18.42,17.4 18.42,15.37 16.73,15.37
+5V on Top Layer: 1.88,14.18 6.54,14.18 6.54,13.47 1.88,13.47
+5V on Top Layer: 1.27,25.91 6.39,25.91 6.39,21.59 1.27,21.59
+5V on Top Layer: 54.01,28.19 56.29,28.19 56.29,22.35 54.01,22.35
+5V on Top Layer: 1.27,18.92 3.15,18.92 3.15,13.38 1.27,13.38
+5V on Top Layer: 1.27,25.91 3.18,25.91 3.18,18.79 1.27,18.79
+5V on Top Layer: 49,24.89 59.08,24.89 59.08,22.35 49,22.35
+5V on Top Layer: 3.72,15.88 4.89,15.88 4.89,13.38 3.72,13.38
+5V on Inner2: 3.72,15.88 4.89,15.88 4.89,13.38 3.72,13.38
AGND on Top Layer: 1.91,51.69 52.96,51.69 52.96,43.82 1.91,43.82
GND on Top Layer: -3.43,55.5 61.85,55.5 61.85,-3.68 -3.43,-3.68
GND on Bottom Layer: -2.03,52.96 62.1,52.96 62.1,-3.56 -2.03,-3.56
GND on Inner1: -2.03,52.96 61.98,52.96 61.98,-3.56 -2.03,-3.56
GND on Inner2: -1.27,52.96 61.72,52.96 61.72,-2.54 -1.27,-2.54

Small or netless copper shapes (teardrops, artwork), in the pictures only: 197 on Top Layer, 34 on Bottom Layer, 38 on Inner2

## Text on the board
Bottom Silkscreen Layer: STM32G474RET6 | 2025/6/2
Top Silkscreen Layer: 3.3 | GND | CLK | SWD | C2IN4 | C2IN3 | C1IN4 | C1IN3 | C1IN2 | C1IN1 | C1IN8 | C1IN7 | C1IN6 | TX | RX | 5V | CHC1 | CHC2 | CHD1 | CHD2 | CHF1 | CHF2 | CHE1 | CHE2 | SDA | MOSI | SCL | MISO | SCK | CHA1 | CHA2 | CHB2 | CHB1
